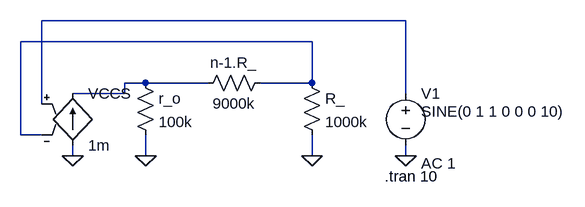
[diagram p0: schematic vccs_negativefb.asc]
vccs_negativefb.asc, the LTspice schematic file:
Version 4
SHEET 1 880 680
WIRE 480 16 -80 16
WIRE 336 48 -112 48
WIRE 80 112 48 112
WIRE 176 112 80 112
WIRE 336 112 336 48
WIRE 336 112 256 112
WIRE 48 128 48 112
WIRE 48 128 -32 128
WIRE 480 128 480 16
WIRE -80 144 -80 16
WIRE -112 192 -112 48
WIRE -80 192 -112 192
WIRE -32 224 -32 208
WIRE 80 224 80 192
WIRE 336 224 336 192
WIRE 480 224 480 208
FLAG 80 224 0
FLAG 336 224 0
FLAG -32 224 0
FLAG 480 224 0
SYMBOL res 64 96 R0
SYMATTR InstName r_o
SYMATTR Value 100k
SYMBOL res 272 96 R90
WINDOW 0 0 56 VBottom 2
WINDOW 3 32 56 VTop 2
SYMATTR InstName n-1.R_
SYMATTR Value 9000k
SYMBOL res 320 96 R0
SYMATTR InstName R_
SYMATTR Value 1000k
SYMBOL g -32 112 R0
SYMATTR InstName VCCS
SYMATTR Value 1m
SYMBOL voltage 480 112 R0
WINDOW 123 24 124 Left 2
WINDOW 39 0 0 Left 0
WINDOW 3 24 44 Left 2
SYMATTR Value2 AC 1
SYMATTR InstName V1
SYMATTR Value SINE(0 1 1 0 0 0 10)
TEXT 448 256 Left 2 !.tran 10

The netlist it stands for:
* vccs_negativefb.asc
r_o N003 0 100k
R§n-1.R_ N002 N003 9000k
R_ N002 0 1000k
G§VCCS 0 N003 N001 N002 1m
V1 N001 0 SINE(0 1 1 0 0 0 10) AC 1
.tran 10
.backanno
.end